# Altium project KNX-RELAY-8CH_V2.PrjPcb
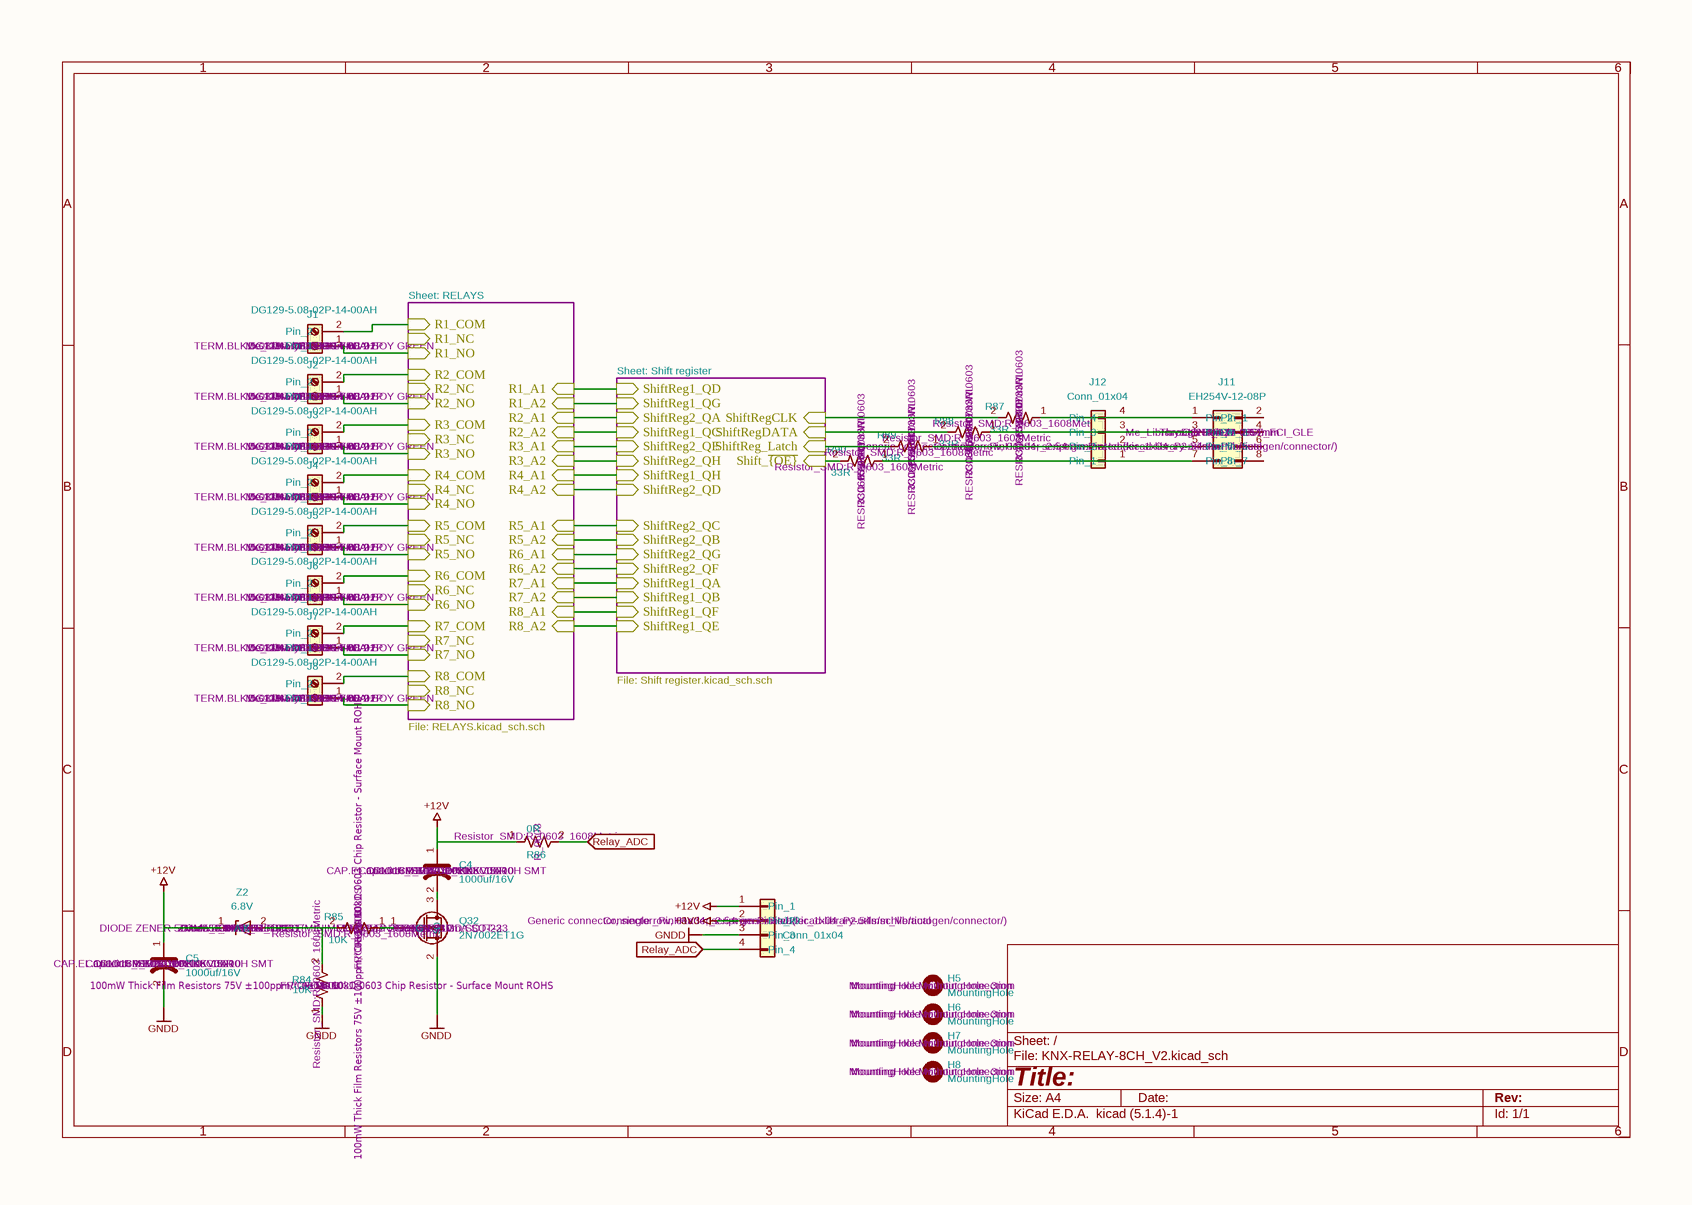
[diagram p0: KNX-RELAY-8CH_V2.SchDoc]
3 sheets, 102 parts. Net scope: hierarchical (ports join the sheet entries above them; power ports are global).
Board file: KNX-RELAY-8CH_V2.PcbDoc
Sheets:
  KNX-RELAY-8CH_V2.SchDoc
    RELAYS = RELAYS.SchDoc
    Shift register = Shift register.SchDoc

## Sheet KNX-RELAY-8CH_V2.SchDoc
size 297 x 209 mm

### Parts
C4  Description: CAP.EL.1000uF 16V 10x10 105C 5000H SMT  MP: CDL016M102G10PKKKV00R  MF: SUSCON  Footprint: Capacitor_SMD:CP_Elec_10x10  [CP_Elec_10x10]  (hidden comment: 1000uf/16V)
C5  Description: CAP.EL.1000uF 16V 10x10 105C 5000H SMT  MP: CDL016M102G10PKKKV00R  MF: SUSCON  Footprint: Capacitor_SMD:CP_Elec_10x10  [CP_Elec_10x10]  (hidden comment: 1000uf/16V)
H5  Description: Mounting Hole without connection  Footprint: MountingHole:MountingHole_3mm  [MountingHole_3mm]  (hidden comment: MountingHole)
H6  Description: Mounting Hole without connection  Footprint: MountingHole:MountingHole_3mm  [MountingHole_3mm]  (hidden comment: MountingHole)
H7  Description: Mounting Hole without connection  Footprint: MountingHole:MountingHole_3mm  [MountingHole_3mm]  (hidden comment: MountingHole)
H8  Description: Mounting Hole without connection  Footprint: MountingHole:MountingHole_3mm  [MountingHole_3mm]  (hidden comment: MountingHole)
J1  Description: TERM.BLK.5.08MM 2P PCB TYPE 2 BOY GREEN  MF: DEGSON  Package: THT V/T  5.08mm  Footprint: Me_Library:DG129-5.08-02P  [DG129-5.08-02P]  (hidden comment: DG129-5.08-02P-14-00AH)
J2  Description: TERM.BLK.5.08MM 2P PCB TYPE 2 BOY GREEN  MF: DEGSON  Package: THT V/T  5.08mm  Footprint: Me_Library:DG129-5.08-02P  [DG129-5.08-02P]  (hidden comment: DG129-5.08-02P-14-00AH)
J3  Description: TERM.BLK.5.08MM 2P PCB TYPE 2 BOY GREEN  MF: DEGSON  Package: THT V/T  5.08mm  Footprint: Me_Library:DG129-5.08-02P  [DG129-5.08-02P]  (hidden comment: DG129-5.08-02P-14-00AH)
J4  Description: TERM.BLK.5.08MM 2P PCB TYPE 2 BOY GREEN  MF: DEGSON  Package: THT V/T  5.08mm  Footprint: Me_Library:DG129-5.08-02P  [DG129-5.08-02P]  (hidden comment: DG129-5.08-02P-14-00AH)
J5  Description: TERM.BLK.5.08MM 2P PCB TYPE 2 BOY GREEN  MF: DEGSON  Package: THT V/T  5.08mm  Footprint: Me_Library:DG129-5.08-02P  [DG129-5.08-02P]  (hidden comment: DG129-5.08-02P-14-00AH)
J6  Description: TERM.BLK.5.08MM 2P PCB TYPE 2 BOY GREEN  MF: DEGSON  Package: THT V/T  5.08mm  Footprint: Me_Library:DG129-5.08-02P  [DG129-5.08-02P]  (hidden comment: DG129-5.08-02P-14-00AH)
J7  Description: TERM.BLK.5.08MM 2P PCB TYPE 2 BOY GREEN  MF: DEGSON  Package: THT V/T  5.08mm  Footprint: Me_Library:DG129-5.08-02P  [DG129-5.08-02P]  (hidden comment: DG129-5.08-02P-14-00AH)
J8  Description: TERM.BLK.5.08MM 2P PCB TYPE 2 BOY GREEN  MF: DEGSON  Package: THT V/T  5.08mm  Footprint: Me_Library:DG129-5.08-02P  [DG129-5.08-02P]  (hidden comment: DG129-5.08-02P-14-00AH)
J10  Description: Generic connector, single row, 01x04, script generated (kicad-library-utils/schlib/autogen/connector/)  Footprint: Connector_PinHeader_2.54mm:PinHeader_1x04_P2.54mm_Vertical  [PinHeader_1x04_P2.54mm_Vertical]  (hidden comment: Conn_01x04)
J11  Description: Through Hole,P=2.54mm  MF: XFCN  Footprint: Me_Library:CON8_2X4_USZ_FCI_GLE  [CON8_2X4_USZ_FCI_GLE]  (hidden comment: EH254V-12-08P)
J12  Description: Generic connector, single row, 01x04, script generated (kicad-library-utils/schlib/autogen/connector/)  Footprint: Connector_PinHeader_2.54mm:PinHeader_1x04_P2.54mm_Vertical  [PinHeader_1x04_P2.54mm_Vertical]  (hidden comment: Conn_01x04)
Q32  Description: MOSFET N-CH 60V 310mA SOT-23  MF: onsemi  Footprint: Package_TO_SOT_SMD:SOT-23  [SOT-23]  (hidden comment: 2N7002ET1G)
R84  Description: 100mW Thick Film Resistors 75V ±100ppm/℃ ±5% 10kΩ 0603 Chip Resistor - Surface Mount ROHS  MP: FRC0603J103TS  MF: FOJAN  Package: R_0603  Footprint: Resistor_SMD:R_0603_1608Metric  [R_0603_1608Metric]  (hidden comment: 10K)
R85  Description: 100mW Thick Film Resistors 75V ±100ppm/℃ ±5% 10kΩ 0603 Chip Resistor - Surface Mount ROHS  MP: FRC0603J103TS  MF: FOJAN  Package: R_0603  Footprint: Resistor_SMD:R_0603_1608Metric  [R_0603_1608Metric]  (hidden comment: 10K)
R86  Package: R_0603  Footprint: Resistor_SMD:R_0603_1608Metric  [R_0603_1608Metric]  (hidden comment: 0R)
R87  Description: RES 33Ω ±5% 100mW 0603  MP: RC0603JR-0733RL  MF: YAGEO  Package: R_0603  Footprint: Resistor_SMD:R_0603_1608Metric  [R_0603_1608Metric]  (hidden comment: 33R)
R88  Description: RES 33Ω ±5% 100mW 0603  MP: RC0603JR-0733RL  MF: YAGEO  Package: R_0603  Footprint: Resistor_SMD:R_0603_1608Metric  [R_0603_1608Metric]  (hidden comment: 33R)
R89  Description: RES 33Ω ±5% 100mW 0603  MP: RC0603JR-0733RL  MF: YAGEO  Package: R_0603  Footprint: Resistor_SMD:R_0603_1608Metric  [R_0603_1608Metric]  (hidden comment: 33R)
R90  Description: RES 33Ω ±5% 100mW 0603  MP: RC0603JR-0733RL  MF: YAGEO  Package: R_0603  Footprint: Resistor_SMD:R_0603_1608Metric  [R_0603_1608Metric]  (hidden comment: 33R)
Z2  Description: DIODE ZENER 500mW 6.8V ±5% SOD80 (MINIMELF) SMT  MP: ZMM55-C6V8_R1_10001  MF: PANJIT  Footprint: Diode_SMD:D_MiniMELF  [D_MiniMELF]  (hidden comment: 6.8V)

### Sub-sheets
RELAYS = RELAYS.SchDoc: R1_A1 (in), R1_A2 (in), R1_COM (in), R1_NC (in), R1_NO (in), R2_A1 (in), R2_A2 (in), R2_COM (in), R2_NC (in), R2_NO (in), R3_A1 (in), R3_A2 (in), R3_COM (in), R3_NC (in), R3_NO (in), R4_A1 (in), R4_A2 (in), R4_COM (in), R4_NC (in), R4_NO (in), R5_A1 (in), R5_A2 (in), R5_COM (in), R5_NC (in), R5_NO (in), R6_A1 (in), R6_A2 (in), R6_COM (in), R6_NC (in), R6_NO (in), R7_A1 (in), R7_A2 (in), R7_COM (in), R7_NC (in), R7_NO (in), R8_A1 (in), R8_A2 (in), R8_COM (in), R8_NC (in), R8_NO (in)
Shift register = Shift register.SchDoc: ShiftReg1_QA (in), ShiftReg1_QB (in), ShiftReg1_QC (in), ShiftReg1_QD (in), ShiftReg1_QE (in), ShiftReg1_QF (in), ShiftReg1_QG (in), ShiftReg1_QH (in), ShiftReg2_QA (in), ShiftReg2_QB (in), ShiftReg2_QC (in), ShiftReg2_QD (in), ShiftReg2_QE (in), ShiftReg2_QF (in), ShiftReg2_QG (in), ShiftReg2_QH (in), ShiftRegCLK (in), ShiftRegDATA (in), ShiftReg_Latch (in), Shift_~{{OE}} (in)

### Ports
Relay_ADC (in)

### Nets
+3V3: J10.2(Pin_2)
+12V: C4.1 C5.1 J10.1(Pin_1) R86.1 Z2.1(K)
GNDD: C5.2 J10.3(Pin_3) Q32.2(S) R84.1
R1_A1: sheet RELAYS/R1_A1, sheet Shift register/ShiftReg1_QD
R1_A2: sheet RELAYS/R1_A2, sheet Shift register/ShiftReg1_QG
R1_COM: J1.2(Pin_2) ; sheet RELAYS/R1_COM
R1_NO: J1.1(Pin_1) ; sheet RELAYS/R1_NO
R2_A1: sheet RELAYS/R2_A1, sheet Shift register/ShiftReg2_QA
R2_A2: sheet RELAYS/R2_A2, sheet Shift register/ShiftReg1_QC
R2_COM: J2.2(Pin_2) ; sheet RELAYS/R2_COM
R2_NO: J2.1(Pin_1) ; sheet RELAYS/R2_NO
R3_A1: sheet RELAYS/R3_A1, sheet Shift register/ShiftReg2_QE
R3_A2: sheet RELAYS/R3_A2, sheet Shift register/ShiftReg2_QH
R3_COM: J3.2(Pin_2) ; sheet RELAYS/R3_COM
R3_NO: J3.1(Pin_1) ; sheet RELAYS/R3_NO
R4_A1: sheet RELAYS/R4_A1, sheet Shift register/ShiftReg1_QH
R4_A2: sheet RELAYS/R4_A2, sheet Shift register/ShiftReg2_QD
R4_COM: J4.2(Pin_2) ; sheet RELAYS/R4_COM
R4_NO: J4.1(Pin_1) ; sheet RELAYS/R4_NO
R5_A1: sheet RELAYS/R5_A1, sheet Shift register/ShiftReg2_QC
R5_A2: sheet RELAYS/R5_A2, sheet Shift register/ShiftReg2_QB
R5_COM: J5.2(Pin_2) ; sheet RELAYS/R5_COM
R5_NO: J5.1(Pin_1) ; sheet RELAYS/R5_NO
R6_A1: sheet RELAYS/R6_A1, sheet Shift register/ShiftReg2_QG
R6_A2: sheet RELAYS/R6_A2, sheet Shift register/ShiftReg2_QF
R6_COM: J6.2(Pin_2) ; sheet RELAYS/R6_COM
R6_NO: J6.1(Pin_1) ; sheet RELAYS/R6_NO
R7_A1: sheet RELAYS/R7_A1, sheet Shift register/ShiftReg1_QA
R7_A2: sheet RELAYS/R7_A2, sheet Shift register/ShiftReg1_QB
R7_COM: J7.2(Pin_2) ; sheet RELAYS/R7_COM
R7_NO: J7.1(Pin_1) ; sheet RELAYS/R7_NO
R8_A1: sheet RELAYS/R8_A1, sheet Shift register/ShiftReg1_QF
R8_A2: sheet RELAYS/R8_A2, sheet Shift register/ShiftReg1_QE
R8_COM: J8.2(Pin_2) ; sheet RELAYS/R8_COM
R8_NO: J8.1(Pin_1) ; sheet RELAYS/R8_NO
Relay_ADC: J10.4(Pin_4) R86.2 ; port Relay_ADC
Shift_~{{OE}}: R90.2 ; sheet Shift register/Shift_~{{OE}}
ShiftReg_Latch: R89.2 ; sheet Shift register/ShiftReg_Latch
ShiftRegCLK: R87.2 ; sheet Shift register/ShiftRegCLK
ShiftRegDATA: R88.2 ; sheet Shift register/ShiftRegDATA
NetC4_2: C4.2 Q32.3(D)
NetJ11_1: J11.1(Pin_1) J12.4(Pin_4) R87.1
NetJ11_3: J11.3(Pin_3) J12.3(Pin_3) R88.1
NetJ11_5: J11.5(Pin_5) J12.2(Pin_2) R89.1
NetJ11_7: J11.7(Pin_7) J12.1(Pin_1) R90.1
NetQ32_1: Q32.1(G) R85.1
NetR84_2: R84.2 R85.2 Z2.2(A)

Not connected (* = marked no-connect by the designer): J11 2(Pin_2) 4(Pin_4) 6(Pin_6) 8(Pin_8)

### Notes on the sheet
- Sheet: RELAYS
- Sheet: Shift register
- File: RELAYS.kicad_sch.sch
- File: Shift register.kicad_sch.sch
- 1
- 2
- 3
- 4
- 5
- 6
- A
- B
- C
- D
- Title:
- File: KNX-RELAY-8CH_V2.kicad_sch
- Sheet: /
- KiCad E.D.A.  kicad (5.1.4)-1
- Size: A4
- Date:
- Rev:
- Id: 1/1

### Library data of the parts
C4 C5 = C_US: Package: CP_Elec_10x10; OZD: CDL016M102G10PKKKV00R; Value: 1000uf/16V
J1-J8 = Screw_Terminal_01x02: MP: DG129-5.08-02P-14-00AH; OZD: DG129-5.08-02P-14-00AH; Value: DG129-5.08-02P-14-00AH
J11 = Conn_02x04_Odd_Even: MP: EH254V-12-08P; Package: Through Hole,P=2.54mm; Value: EH254V-12-08P
Q32 = Q_NMOS_Depletion_GSD: MP: 2N7002ET1G; Package: SOT-23; OZD: 2N7002ET1G; Value: 2N7002ET1G
R84-R90 = R_US
  R84 R85: Value: 10K
  R86: Value: 0R
  R87-R90: OZD: RC0603JR-0733RL; Value: 33R
Z2 = D_Zener: Package: D_MiniMELF; OZD: ZMM55-C6V8_R1_10001; Value: 6.8V
H5-H8 = MountingHole: Value: MountingHole
J10 J12 = Conn_01x04: Value: Conn_01x04

## Sheet RELAYS.SchDoc
size 420 x 297 mm
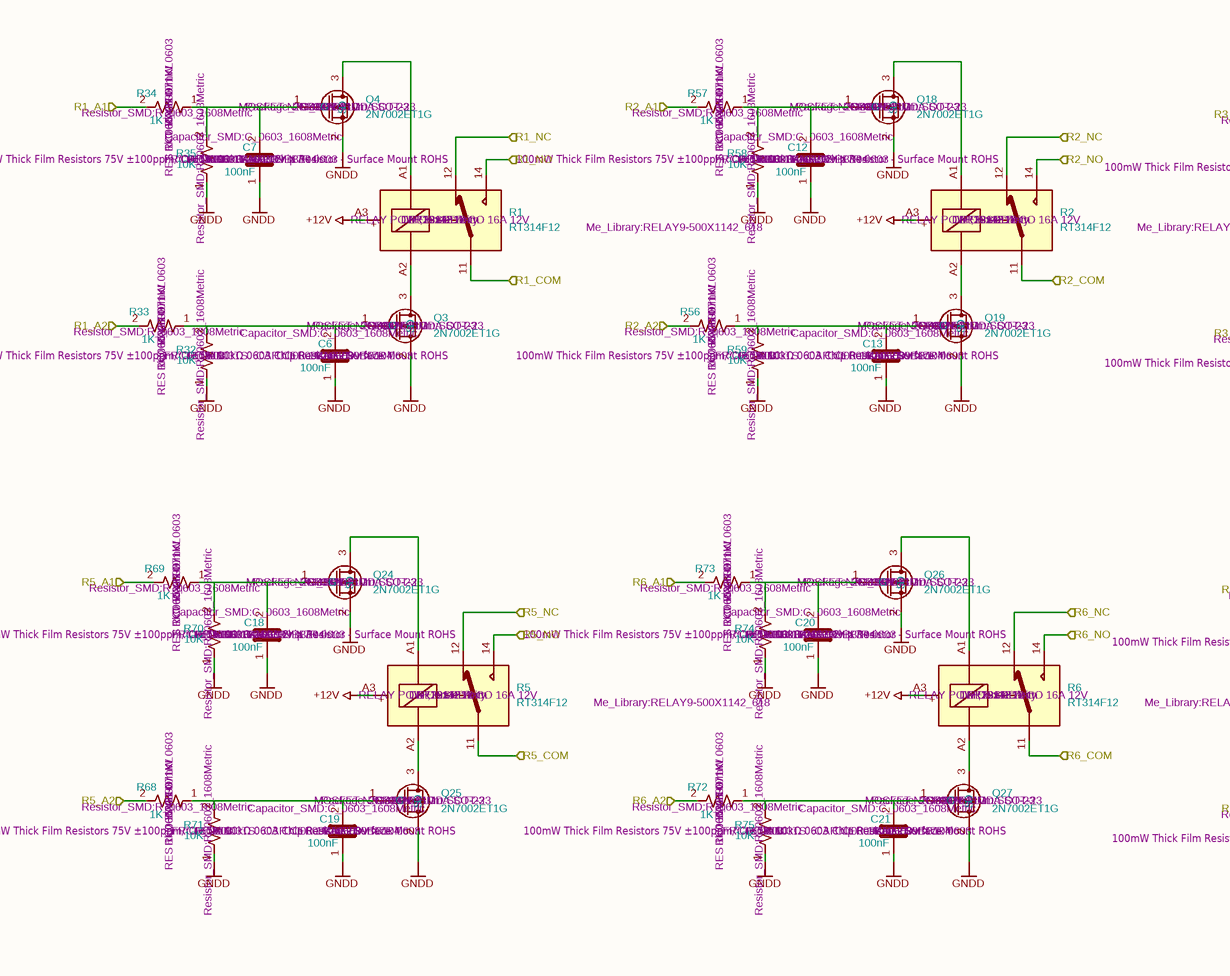
[diagram p1: RELAYS.SchDoc, left]
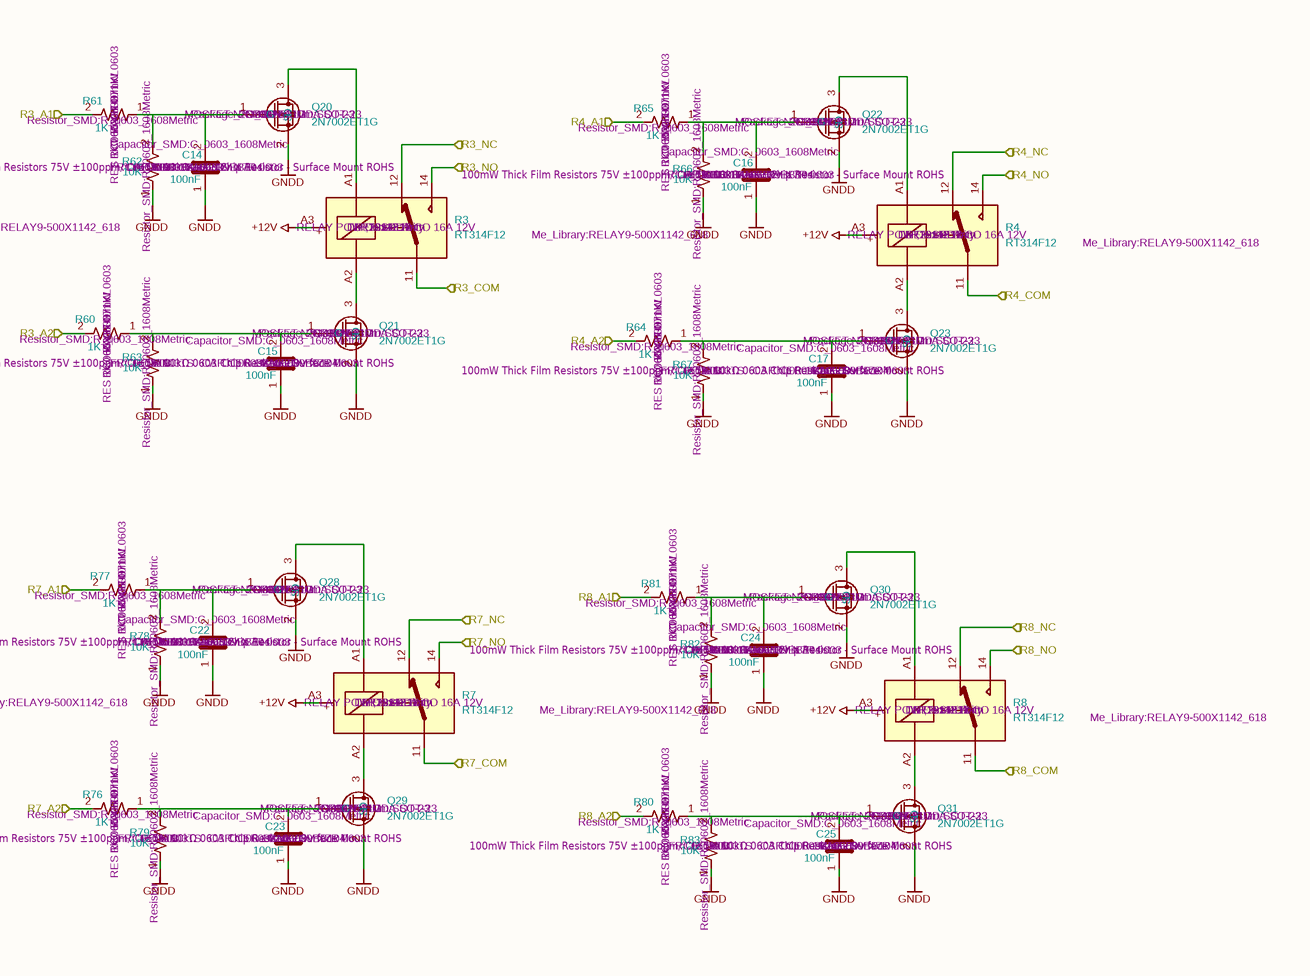
[diagram p2: RELAYS.SchDoc, right]

### Parts
C6  Description: CAP CER 100nF 50V X7R 0603  MP: CC0603KRX7R9BB104  MF: YAGEO  Package: C_0603  Footprint: Capacitor_SMD:C_0603_1608Metric  [C_0603_1608Metric]  (hidden comment: 100nF)
C7  Description: CAP CER 100nF 50V X7R 0603  MP: CC0603KRX7R9BB104  MF: YAGEO  Package: C_0603  Footprint: Capacitor_SMD:C_0603_1608Metric  [C_0603_1608Metric]  (hidden comment: 100nF)
C12  Description: CAP CER 100nF 50V X7R 0603  MP: CC0603KRX7R9BB104  MF: YAGEO  Package: C_0603  Footprint: Capacitor_SMD:C_0603_1608Metric  [C_0603_1608Metric]  (hidden comment: 100nF)
C13  Description: CAP CER 100nF 50V X7R 0603  MP: CC0603KRX7R9BB104  MF: YAGEO  Package: C_0603  Footprint: Capacitor_SMD:C_0603_1608Metric  [C_0603_1608Metric]  (hidden comment: 100nF)
C14  Description: CAP CER 100nF 50V X7R 0603  MP: CC0603KRX7R9BB104  MF: YAGEO  Package: C_0603  Footprint: Capacitor_SMD:C_0603_1608Metric  [C_0603_1608Metric]  (hidden comment: 100nF)
C15  Description: CAP CER 100nF 50V X7R 0603  MP: CC0603KRX7R9BB104  MF: YAGEO  Package: C_0603  Footprint: Capacitor_SMD:C_0603_1608Metric  [C_0603_1608Metric]  (hidden comment: 100nF)
C16  Description: CAP CER 100nF 50V X7R 0603  MP: CC0603KRX7R9BB104  MF: YAGEO  Package: C_0603  Footprint: Capacitor_SMD:C_0603_1608Metric  [C_0603_1608Metric]  (hidden comment: 100nF)
C17  Description: CAP CER 100nF 50V X7R 0603  MP: CC0603KRX7R9BB104  MF: YAGEO  Package: C_0603  Footprint: Capacitor_SMD:C_0603_1608Metric  [C_0603_1608Metric]  (hidden comment: 100nF)
C18  Description: CAP CER 100nF 50V X7R 0603  MP: CC0603KRX7R9BB104  MF: YAGEO  Package: C_0603  Footprint: Capacitor_SMD:C_0603_1608Metric  [C_0603_1608Metric]  (hidden comment: 100nF)
C19  Description: CAP CER 100nF 50V X7R 0603  MP: CC0603KRX7R9BB104  MF: YAGEO  Package: C_0603  Footprint: Capacitor_SMD:C_0603_1608Metric  [C_0603_1608Metric]  (hidden comment: 100nF)
C20  Description: CAP CER 100nF 50V X7R 0603  MP: CC0603KRX7R9BB104  MF: YAGEO  Package: C_0603  Footprint: Capacitor_SMD:C_0603_1608Metric  [C_0603_1608Metric]  (hidden comment: 100nF)
C21  Description: CAP CER 100nF 50V X7R 0603  MP: CC0603KRX7R9BB104  MF: YAGEO  Package: C_0603  Footprint: Capacitor_SMD:C_0603_1608Metric  [C_0603_1608Metric]  (hidden comment: 100nF)
C22  Description: CAP CER 100nF 50V X7R 0603  MP: CC0603KRX7R9BB104  MF: YAGEO  Package: C_0603  Footprint: Capacitor_SMD:C_0603_1608Metric  [C_0603_1608Metric]  (hidden comment: 100nF)
C23  Description: CAP CER 100nF 50V X7R 0603  MP: CC0603KRX7R9BB104  MF: YAGEO  Package: C_0603  Footprint: Capacitor_SMD:C_0603_1608Metric  [C_0603_1608Metric]  (hidden comment: 100nF)
C24  Description: CAP CER 100nF 50V X7R 0603  MP: CC0603KRX7R9BB104  MF: YAGEO  Package: C_0603  Footprint: Capacitor_SMD:C_0603_1608Metric  [C_0603_1608Metric]  (hidden comment: 100nF)
C25  Description: CAP CER 100nF 50V X7R 0603  MP: CC0603KRX7R9BB104  MF: YAGEO  Package: C_0603  Footprint: Capacitor_SMD:C_0603_1608Metric  [C_0603_1608Metric]  (hidden comment: 100nF)
Q3  Description: MOSFET N-CH 60V 310mA SOT-23  MF: onsemi  Footprint: Package_TO_SOT_SMD:SOT-23  [SOT-23]  (hidden comment: 2N7002ET1G)
Q4  Description: MOSFET N-CH 60V 310mA SOT-23  MF: onsemi  Footprint: Package_TO_SOT_SMD:SOT-23  [SOT-23]  (hidden comment: 2N7002ET1G)
Q18  Description: MOSFET N-CH 60V 310mA SOT-23  MF: onsemi  Footprint: Package_TO_SOT_SMD:SOT-23  [SOT-23]  (hidden comment: 2N7002ET1G)
Q19  Description: MOSFET N-CH 60V 310mA SOT-23  MF: onsemi  Footprint: Package_TO_SOT_SMD:SOT-23  [SOT-23]  (hidden comment: 2N7002ET1G)
Q20  Description: MOSFET N-CH 60V 310mA SOT-23  MF: onsemi  Footprint: Package_TO_SOT_SMD:SOT-23  [SOT-23]  (hidden comment: 2N7002ET1G)
Q21  Description: MOSFET N-CH 60V 310mA SOT-23  MF: onsemi  Footprint: Package_TO_SOT_SMD:SOT-23  [SOT-23]  (hidden comment: 2N7002ET1G)
Q22  Description: MOSFET N-CH 60V 310mA SOT-23  MF: onsemi  Footprint: Package_TO_SOT_SMD:SOT-23  [SOT-23]  (hidden comment: 2N7002ET1G)
Q23  Description: MOSFET N-CH 60V 310mA SOT-23  MF: onsemi  Footprint: Package_TO_SOT_SMD:SOT-23  [SOT-23]  (hidden comment: 2N7002ET1G)
Q24  Description: MOSFET N-CH 60V 310mA SOT-23  MF: onsemi  Footprint: Package_TO_SOT_SMD:SOT-23  [SOT-23]  (hidden comment: 2N7002ET1G)
Q25  Description: MOSFET N-CH 60V 310mA SOT-23  MF: onsemi  Footprint: Package_TO_SOT_SMD:SOT-23  [SOT-23]  (hidden comment: 2N7002ET1G)
Q26  Description: MOSFET N-CH 60V 310mA SOT-23  MF: onsemi  Footprint: Package_TO_SOT_SMD:SOT-23  [SOT-23]  (hidden comment: 2N7002ET1G)
Q27  Description: MOSFET N-CH 60V 310mA SOT-23  MF: onsemi  Footprint: Package_TO_SOT_SMD:SOT-23  [SOT-23]  (hidden comment: 2N7002ET1G)
Q28  Description: MOSFET N-CH 60V 310mA SOT-23  MF: onsemi  Footprint: Package_TO_SOT_SMD:SOT-23  [SOT-23]  (hidden comment: 2N7002ET1G)
Q29  Description: MOSFET N-CH 60V 310mA SOT-23  MF: onsemi  Footprint: Package_TO_SOT_SMD:SOT-23  [SOT-23]  (hidden comment: 2N7002ET1G)
Q30  Description: MOSFET N-CH 60V 310mA SOT-23  MF: onsemi  Footprint: Package_TO_SOT_SMD:SOT-23  [SOT-23]  (hidden comment: 2N7002ET1G)
Q31  Description: MOSFET N-CH 60V 310mA SOT-23  MF: onsemi  Footprint: Package_TO_SOT_SMD:SOT-23  [SOT-23]  (hidden comment: 2N7002ET1G)
R1  Description: RELAY POWER SPDT-CO 16A 12V  MF: TE Connectivity  Package: DIP,29x12.7mm  Footprint: Me_Library:RELAY9-500X1142_618  [RELAY9-500X1142_618]  (hidden comment: RT314F12)
R2  Description: RELAY POWER SPDT-CO 16A 12V  MF: TE Connectivity  Package: DIP,29x12.7mm  Footprint: Me_Library:RELAY9-500X1142_618  [RELAY9-500X1142_618]  (hidden comment: RT314F12)
R3  Description: RELAY POWER SPDT-CO 16A 12V  MF: TE Connectivity  Package: DIP,29x12.7mm  Footprint: Me_Library:RELAY9-500X1142_618  [RELAY9-500X1142_618]  (hidden comment: RT314F12)
R4  Description: RELAY POWER SPDT-CO 16A 12V  MF: TE Connectivity  Package: DIP,29x12.7mm  Footprint: Me_Library:RELAY9-500X1142_618  [RELAY9-500X1142_618]  (hidden comment: RT314F12)
R5  Description: RELAY POWER SPDT-CO 16A 12V  MF: TE Connectivity  Package: DIP,29x12.7mm  Footprint: Me_Library:RELAY9-500X1142_618  [RELAY9-500X1142_618]  (hidden comment: RT314F12)
R6  Description: RELAY POWER SPDT-CO 16A 12V  MF: TE Connectivity  Package: DIP,29x12.7mm  Footprint: Me_Library:RELAY9-500X1142_618  [RELAY9-500X1142_618]  (hidden comment: RT314F12)
R7  Description: RELAY POWER SPDT-CO 16A 12V  MF: TE Connectivity  Package: DIP,29x12.7mm  Footprint: Me_Library:RELAY9-500X1142_618  [RELAY9-500X1142_618]  (hidden comment: RT314F12)
R8  Description: RELAY POWER SPDT-CO 16A 12V  MF: TE Connectivity  Package: DIP,29x12.7mm  Footprint: Me_Library:RELAY9-500X1142_618  [RELAY9-500X1142_618]  (hidden comment: RT314F12)
R32  Description: 100mW Thick Film Resistors 75V ±100ppm/℃ ±5% 10kΩ 0603 Chip Resistor - Surface Mount ROHS  MP: FRC0603J103TS  MF: FOJAN  Package: R_0603  Footprint: Resistor_SMD:R_0603_1608Metric  [R_0603_1608Metric]  (hidden comment: 10K)
R33  Description: RES 1kΩ ±5% 100mW 0603  MP: RC0603JR-071KL  MF: YAGEO  Package: R_0603  Footprint: Resistor_SMD:R_0603_1608Metric  [R_0603_1608Metric]  (hidden comment: 1K)
R34  Description: RES 1kΩ ±5% 100mW 0603  MP: RC0603JR-071KL  MF: YAGEO  Package: R_0603  Footprint: Resistor_SMD:R_0603_1608Metric  [R_0603_1608Metric]  (hidden comment: 1K)
R35  Description: 100mW Thick Film Resistors 75V ±100ppm/℃ ±5% 10kΩ 0603 Chip Resistor - Surface Mount ROHS  MP: FRC0603J103TS  MF: FOJAN  Package: R_0603  Footprint: Resistor_SMD:R_0603_1608Metric  [R_0603_1608Metric]  (hidden comment: 10K)
R56  Description: RES 1kΩ ±5% 100mW 0603  MP: RC0603JR-071KL  MF: YAGEO  Package: R_0603  Footprint: Resistor_SMD:R_0603_1608Metric  [R_0603_1608Metric]  (hidden comment: 1K)
R57  Description: RES 1kΩ ±5% 100mW 0603  MP: RC0603JR-071KL  MF: YAGEO  Package: R_0603  Footprint: Resistor_SMD:R_0603_1608Metric  [R_0603_1608Metric]  (hidden comment: 1K)
R58  Description: 100mW Thick Film Resistors 75V ±100ppm/℃ ±5% 10kΩ 0603 Chip Resistor - Surface Mount ROHS  MP: FRC0603J103TS  MF: FOJAN  Package: R_0603  Footprint: Resistor_SMD:R_0603_1608Metric  [R_0603_1608Metric]  (hidden comment: 10K)
R59  Description: 100mW Thick Film Resistors 75V ±100ppm/℃ ±5% 10kΩ 0603 Chip Resistor - Surface Mount ROHS  MP: FRC0603J103TS  MF: FOJAN  Package: R_0603  Footprint: Resistor_SMD:R_0603_1608Metric  [R_0603_1608Metric]  (hidden comment: 10K)
R60  Description: RES 1kΩ ±5% 100mW 0603  MP: RC0603JR-071KL  MF: YAGEO  Package: R_0603  Footprint: Resistor_SMD:R_0603_1608Metric  [R_0603_1608Metric]  (hidden comment: 1K)
R61  Description: RES 1kΩ ±5% 100mW 0603  MP: RC0603JR-071KL  MF: YAGEO  Package: R_0603  Footprint: Resistor_SMD:R_0603_1608Metric  [R_0603_1608Metric]  (hidden comment: 1K)
R62  Description: 100mW Thick Film Resistors 75V ±100ppm/℃ ±5% 10kΩ 0603 Chip Resistor - Surface Mount ROHS  MP: FRC0603J103TS  MF: FOJAN  Package: R_0603  Footprint: Resistor_SMD:R_0603_1608Metric  [R_0603_1608Metric]  (hidden comment: 10K)
R63  Description: 100mW Thick Film Resistors 75V ±100ppm/℃ ±5% 10kΩ 0603 Chip Resistor - Surface Mount ROHS  MP: FRC0603J103TS  MF: FOJAN  Package: R_0603  Footprint: Resistor_SMD:R_0603_1608Metric  [R_0603_1608Metric]  (hidden comment: 10K)
R64  Description: RES 1kΩ ±5% 100mW 0603  MP: RC0603JR-071KL  MF: YAGEO  Package: R_0603  Footprint: Resistor_SMD:R_0603_1608Metric  [R_0603_1608Metric]  (hidden comment: 1K)
R65  Description: RES 1kΩ ±5% 100mW 0603  MP: RC0603JR-071KL  MF: YAGEO  Package: R_0603  Footprint: Resistor_SMD:R_0603_1608Metric  [R_0603_1608Metric]  (hidden comment: 1K)
R66  Description: 100mW Thick Film Resistors 75V ±100ppm/℃ ±5% 10kΩ 0603 Chip Resistor - Surface Mount ROHS  MP: FRC0603J103TS  MF: FOJAN  Package: R_0603  Footprint: Resistor_SMD:R_0603_1608Metric  [R_0603_1608Metric]  (hidden comment: 10K)
R67  Description: 100mW Thick Film Resistors 75V ±100ppm/℃ ±5% 10kΩ 0603 Chip Resistor - Surface Mount ROHS  MP: FRC0603J103TS  MF: FOJAN  Package: R_0603  Footprint: Resistor_SMD:R_0603_1608Metric  [R_0603_1608Metric]  (hidden comment: 10K)
R68  Description: RES 1kΩ ±5% 100mW 0603  MP: RC0603JR-071KL  MF: YAGEO  Package: R_0603  Footprint: Resistor_SMD:R_0603_1608Metric  [R_0603_1608Metric]  (hidden comment: 1K)
R69  Description: RES 1kΩ ±5% 100mW 0603  MP: RC0603JR-071KL  MF: YAGEO  Package: R_0603  Footprint: Resistor_SMD:R_0603_1608Metric  [R_0603_1608Metric]  (hidden comment: 1K)
R70  Description: 100mW Thick Film Resistors 75V ±100ppm/℃ ±5% 10kΩ 0603 Chip Resistor - Surface Mount ROHS  MP: FRC0603J103TS  MF: FOJAN  Package: R_0603  Footprint: Resistor_SMD:R_0603_1608Metric  [R_0603_1608Metric]  (hidden comment: 10K)
R71  Description: 100mW Thick Film Resistors 75V ±100ppm/℃ ±5% 10kΩ 0603 Chip Resistor - Surface Mount ROHS  MP: FRC0603J103TS  MF: FOJAN  Package: R_0603  Footprint: Resistor_SMD:R_0603_1608Metric  [R_0603_1608Metric]  (hidden comment: 10K)
R72  Description: RES 1kΩ ±5% 100mW 0603  MP: RC0603JR-071KL  MF: YAGEO  Package: R_0603  Footprint: Resistor_SMD:R_0603_1608Metric  [R_0603_1608Metric]  (hidden comment: 1K)
R73  Description: RES 1kΩ ±5% 100mW 0603  MP: RC0603JR-071KL  MF: YAGEO  Package: R_0603  Footprint: Resistor_SMD:R_0603_1608Metric  [R_0603_1608Metric]  (hidden comment: 1K)
R74  Description: 100mW Thick Film Resistors 75V ±100ppm/℃ ±5% 10kΩ 0603 Chip Resistor - Surface Mount ROHS  MP: FRC0603J103TS  MF: FOJAN  Package: R_0603  Footprint: Resistor_SMD:R_0603_1608Metric  [R_0603_1608Metric]  (hidden comment: 10K)
R75  Description: 100mW Thick Film Resistors 75V ±100ppm/℃ ±5% 10kΩ 0603 Chip Resistor - Surface Mount ROHS  MP: FRC0603J103TS  MF: FOJAN  Package: R_0603  Footprint: Resistor_SMD:R_0603_1608Metric  [R_0603_1608Metric]  (hidden comment: 10K)
R76  Description: RES 1kΩ ±5% 100mW 0603  MP: RC0603JR-071KL  MF: YAGEO  Package: R_0603  Footprint: Resistor_SMD:R_0603_1608Metric  [R_0603_1608Metric]  (hidden comment: 1K)
R77  Description: RES 1kΩ ±5% 100mW 0603  MP: RC0603JR-071KL  MF: YAGEO  Package: R_0603  Footprint: Resistor_SMD:R_0603_1608Metric  [R_0603_1608Metric]  (hidden comment: 1K)
R78  Description: 100mW Thick Film Resistors 75V ±100ppm/℃ ±5% 10kΩ 0603 Chip Resistor - Surface Mount ROHS  MP: FRC0603J103TS  MF: FOJAN  Package: R_0603  Footprint: Resistor_SMD:R_0603_1608Metric  [R_0603_1608Metric]  (hidden comment: 10K)
R79  Description: 100mW Thick Film Resistors 75V ±100ppm/℃ ±5% 10kΩ 0603 Chip Resistor - Surface Mount ROHS  MP: FRC0603J103TS  MF: FOJAN  Package: R_0603  Footprint: Resistor_SMD:R_0603_1608Metric  [R_0603_1608Metric]  (hidden comment: 10K)
R80  Description: RES 1kΩ ±5% 100mW 0603  MP: RC0603JR-071KL  MF: YAGEO  Package: R_0603  Footprint: Resistor_SMD:R_0603_1608Metric  [R_0603_1608Metric]  (hidden comment: 1K)
R81  Description: RES 1kΩ ±5% 100mW 0603  MP: RC0603JR-071KL  MF: YAGEO  Package: R_0603  Footprint: Resistor_SMD:R_0603_1608Metric  [R_0603_1608Metric]  (hidden comment: 1K)
R82  Description: 100mW Thick Film Resistors 75V ±100ppm/℃ ±5% 10kΩ 0603 Chip Resistor - Surface Mount ROHS  MP: FRC0603J103TS  MF: FOJAN  Package: R_0603  Footprint: Resistor_SMD:R_0603_1608Metric  [R_0603_1608Metric]  (hidden comment: 10K)
R83  Description: 100mW Thick Film Resistors 75V ±100ppm/℃ ±5% 10kΩ 0603 Chip Resistor - Surface Mount ROHS  MP: FRC0603J103TS  MF: FOJAN  Package: R_0603  Footprint: Resistor_SMD:R_0603_1608Metric  [R_0603_1608Metric]  (hidden comment: 10K)

### Ports
R1_A1 (in), R1_A2 (in), R1_COM (in), R1_NC (in), R1_NO (in), R2_A1 (in), R2_A2 (in), R2_COM (in), R2_NC (in), R2_NO (in), R3_A1 (in), R3_A2 (in), R3_COM (in), R3_NC (in), R3_NO (in), R4_A1 (in), R4_A2 (in), R4_COM (in), R4_NC (in), R4_NO (in), R5_A1 (in), R5_A2 (in), R5_COM (in), R5_NC (in), R5_NO (in), R6_A1 (in), R6_A2 (in), R6_COM (in), R6_NC (in), R6_NO (in), R7_A1 (in), R7_A2 (in), R7_COM (in), R7_NC (in), R7_NO (in), R8_A1 (in), R8_A2 (in), R8_COM (in), R8_NC (in), R8_NO (in)

### Nets
+12V: R1.A3 R2.A3 R3.A3 R4.A3 R5.A3 R6.A3 R7.A3 R8.A3
GNDD: C6.1 C7.1 C12.1 C13.1 C14.1 C15.1 C16.1 C17.1 C18.1 C19.1 C20.1 C21.1 C22.1 C23.1 C24.1 C25.1 Q3.2(S) Q4.2(S) Q18.2(S) Q19.2(S) Q20.2(S) Q21.2(S) Q22.2(S) Q23.2(S) Q24.2(S) Q25.2(S) Q26.2(S) Q27.2(S) Q28.2(S) Q29.2(S) Q30.2(S) Q31.2(S) R32.1 R35.1 R58.1 R59.1 R62.1 R63.1 R66.1 R67.1 R70.1 R71.1 R74.1 R75.1 R78.1 R79.1 R82.1 R83.1
R1_A1: R34.2 ; port R1_A1
R1_A2: R33.2 ; port R1_A2
R1_COM: R1.11 ; port R1_COM
R1_NC: R1.12 ; port R1_NC
R1_NO: R1.14 ; port R1_NO
R2_A1: R57.2 ; port R2_A1
R2_A2: R56.2 ; port R2_A2
R2_COM: R2.11 ; port R2_COM
R2_NC: R2.12 ; port R2_NC
R2_NO: R2.14 ; port R2_NO
R3_A1: R61.2 ; port R3_A1
R3_A2: R60.2 ; port R3_A2
R3_COM: R3.11 ; port R3_COM
R3_NC: R3.12 ; port R3_NC
R3_NO: R3.14 ; port R3_NO
R4_A1: R65.2 ; port R4_A1
R4_A2: R64.2 ; port R4_A2
R4_COM: R4.11 ; port R4_COM
R4_NC: R4.12 ; port R4_NC
R4_NO: R4.14 ; port R4_NO
R5_A1: R69.2 ; port R5_A1
R5_A2: R68.2 ; port R5_A2
R5_COM: R5.11 ; port R5_COM
R5_NC: R5.12 ; port R5_NC
R5_NO: R5.14 ; port R5_NO
R6_A1: R73.2 ; port R6_A1
R6_A2: R72.2 ; port R6_A2
R6_COM: R6.11 ; port R6_COM
R6_NC: R6.12 ; port R6_NC
R6_NO: R6.14 ; port R6_NO
R7_A1: R77.2 ; port R7_A1
R7_A2: R76.2 ; port R7_A2
R7_COM: R7.11 ; port R7_COM
R7_NC: R7.12 ; port R7_NC
R7_NO: R7.14 ; port R7_NO
R8_A1: R81.2 ; port R8_A1
R8_A2: R80.2 ; port R8_A2
R8_COM: R8.11 ; port R8_COM
R8_NC: R8.12 ; port R8_NC
R8_NO: R8.14 ; port R8_NO
NetC6_2: C6.2 Q3.1(G) R32.2 R33.1
NetC7_2: C7.2 Q4.1(G) R34.1 R35.2
NetC12_2: C12.2 Q18.1(G) R57.1 R58.2
NetC13_2: C13.2 Q19.1(G) R56.1 R59.2
NetC14_2: C14.2 Q20.1(G) R61.1 R62.2
NetC15_2: C15.2 Q21.1(G) R60.1 R63.2
NetC16_2: C16.2 Q22.1(G) R65.1 R66.2
NetC17_2: C17.2 Q23.1(G) R64.1 R67.2
NetC18_2: C18.2 Q24.1(G) R69.1 R70.2
NetC19_2: C19.2 Q25.1(G) R68.1 R71.2
NetC20_2: C20.2 Q26.1(G) R73.1 R74.2
NetC21_2: C21.2 Q27.1(G) R72.1 R75.2
NetC22_2: C22.2 Q28.1(G) R77.1 R78.2
NetC23_2: C23.2 Q29.1(G) R76.1 R79.2
NetC24_2: C24.2 Q30.1(G) R81.1 R82.2
NetC25_2: C25.2 Q31.1(G) R80.1 R83.2
NetQ3_3: Q3.3(D) R1.A2
NetQ4_3: Q4.3(D) R1.A1
NetQ18_3: Q18.3(D) R2.A1
NetQ19_3: Q19.3(D) R2.A2
NetQ20_3: Q20.3(D) R3.A1
NetQ21_3: Q21.3(D) R3.A2
NetQ22_3: Q22.3(D) R4.A1
NetQ23_3: Q23.3(D) R4.A2
NetQ24_3: Q24.3(D) R5.A1
NetQ25_3: Q25.3(D) R5.A2
NetQ26_3: Q26.3(D) R6.A1
NetQ27_3: Q27.3(D) R6.A2
NetQ28_3: Q28.3(D) R7.A1
NetQ29_3: Q29.3(D) R7.A2
NetQ30_3: Q30.3(D) R8.A1
NetQ31_3: Q31.3(D) R8.A2

### Notes on the sheet
- 1
- 2
- 3
- 4
- 5
- 6
- 7
- 8
- A
- B
- C
- D
- E
- Title:
- File: RELAYS.kicad_sch
- Sheet: /
- F
- KiCad E.D.A.  kicad (5.1.4)-1
- Size: A3
- Date:
- Rev:
- Id: 1/1
- (in symbol RT314A03) +

### Library data of the parts
C6 C7 C12-C25 = C_3: Value: 100nF
Q3 Q4 Q18-Q31 = Q_NMOS_Depletion_GSD: MP: 2N7002ET1G; Package: SOT-23; OZD: 2N7002ET1G; Value: 2N7002ET1G
R1-R8 = RT314A03: MP: RT314F12; OZD: RT314F12; Value: RT314F12
R32-R35 R56-R83 = R_US
  R32 R35 R58 R59 R62 R63 R66 R67 R70 R71 R74 R75 R78 R79 R82 R83: Value: 10K
  R33 R34 R56 R57 R60 R61 R64 R65 R68 R69 R72 R73 R76 R77 R80 R81: OZD: RC0603JR-071KL; Value: 1K

## Sheet Shift register.SchDoc
size 297 x 209 mm
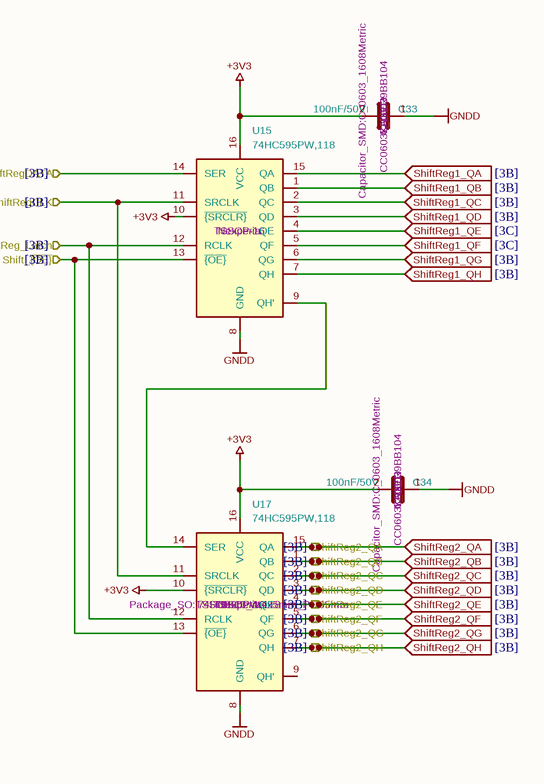
[diagram p3: Shift register.SchDoc]

### Parts
C33  MP: CC0603KRX7R9BB104  MF: YAGEO  Package: C_0603  Footprint: Capacitor_SMD:C_0603_1608Metric  [C_0603_1608Metric]  (hidden comment: 100nF/50V)
C34  MP: CC0603KRX7R9BB104  MF: YAGEO  Package: C_0603  Footprint: Capacitor_SMD:C_0603_1608Metric  [C_0603_1608Metric]  (hidden comment: 100nF/50V)
U15  MF: Nexperia  Package: TSSOP-16  [TSSOP-16_4.4x5mm_P0.65mm]  (hidden comment: 74HC595PW,118)
U17  MF: Nexperia  Package: TSSOP-16  Footprint: Package_SO:TSSOP-16_4.4x5mm_P0.65mm  [TSSOP-16_4.4x5mm_P0.65mm]  (hidden comment: 74HC595PW,118)

### Ports
Shift_~{{OE}} (in, see [3B]), ShiftReg1_QA (in, see [3B]), ShiftReg1_QB (in, see [3B]), ShiftReg1_QC (in, see [3B]), ShiftReg1_QD (in, see [3B]), ShiftReg1_QE (in, see [3C]), ShiftReg1_QF (in, see [3C]), ShiftReg1_QG (in, see [3B]), ShiftReg1_QH (in, see [3B]), ShiftReg2_QA (in, see [3B]), ShiftReg2_QB (in, see [3B]), ShiftReg2_QC (in, see [3B]), ShiftReg2_QD (in, see [3B]), ShiftReg2_QE (in, see [3B]), ShiftReg2_QF (in, see [3B]), ShiftReg2_QG (in, see [3B]), ShiftReg2_QH (in, see [3B]), ShiftReg_Latch (in, see [3B]), ShiftRegCLK (in, see [3B]), ShiftRegDATA (in, see [3B])

### Nets
+3V3: C33.2 C34.2 U15.10(~{{SRCLR}}) U15.16(VCC) U17.10(~{{SRCLR}}) U17.16(VCC)
GNDD: C33.1 C34.1 U15.8(GND) U17.8(GND)
R1_A1: U15.3(QD) ; port ShiftReg1_QD
R1_A2: U15.6(QG) ; port ShiftReg1_QG
R2_A1: U17.15(QA) ; port ShiftReg2_QA
R2_A2: U15.2(QC) ; port ShiftReg1_QC
R3_A1: U17.4(QE) ; port ShiftReg2_QE
R3_A2: U17.7(QH) ; port ShiftReg2_QH
R4_A1: U15.7(QH) ; port ShiftReg1_QH
R4_A2: U17.3(QD) ; port ShiftReg2_QD
R5_A1: U17.2(QC) ; port ShiftReg2_QC
R5_A2: U17.1(QB) ; port ShiftReg2_QB
R6_A1: U17.6(QG) ; port ShiftReg2_QG
R6_A2: U17.5(QF) ; port ShiftReg2_QF
R7_A1: U15.15(QA) ; port ShiftReg1_QA
R7_A2: U15.1(QB) ; port ShiftReg1_QB
R8_A1: U15.5(QF) ; port ShiftReg1_QF
R8_A2: U15.4(QE) ; port ShiftReg1_QE
Shift_~{{OE}}: U15.13(~{{OE}}) U17.13(~{{OE}}) ; port Shift_~{{OE}}
ShiftReg_Latch: U15.12(RCLK) U17.12(RCLK) ; port ShiftReg_Latch
ShiftRegCLK: U15.11(SRCLK) U17.11(SRCLK) ; port ShiftRegCLK
ShiftRegDATA: U15.14(SER) ; port ShiftRegDATA
NetU15_9: U15.9(QH') U17.14(SER)

Not connected (* = marked no-connect by the designer): U17 9(QH')

### Notes on the sheet
- 1
- 2
- 3
- 4
- 5
- 6
- A
- B
- C
- D
- Title:
- File: Shift register.kicad_sch
- Sheet: /
- KiCad E.D.A.  kicad (5.1.4)-1
- Size: A4
- Date:
- Rev:
- Id: 1/1

### Library data of the parts
C33 C34 = C: Value: 100nF/50V
U15 U17 = 74HC595: MP: 74HC595PW,118; Value: 74HC595PW,118
  U15: Footprint: Package_SO:TSSOP-16_4.4x5mm_P0.65mm

## Nets that join several sheets
+3V3: KNX-RELAY-8CH_V2 (J10.2), Shift register (6 pins)
+12V: KNX-RELAY-8CH_V2 (5 pins), RELAYS (8 pins)
GNDD: KNX-RELAY-8CH_V2 (C5.2 J10.3 Q32.2 R84.1), RELAYS (48 pins), Shift register (C33.1 C34.1 U15.8 U17.8)
R1_A1: RELAYS (R34.2), Shift register (U15.3)
R1_A2: RELAYS (R33.2), Shift register (U15.6)
R1_COM: KNX-RELAY-8CH_V2 (J1.2), RELAYS (R1.11)
R1_NO: KNX-RELAY-8CH_V2 (J1.1), RELAYS (R1.14)
R2_A1: RELAYS (R57.2), Shift register (U17.15)
R2_A2: RELAYS (R56.2), Shift register (U15.2)
R2_COM: KNX-RELAY-8CH_V2 (J2.2), RELAYS (R2.11)
R2_NO: KNX-RELAY-8CH_V2 (J2.1), RELAYS (R2.14)
R3_A1: RELAYS (R61.2), Shift register (U17.4)
R3_A2: RELAYS (R60.2), Shift register (U17.7)
R3_COM: KNX-RELAY-8CH_V2 (J3.2), RELAYS (R3.11)
R3_NO: KNX-RELAY-8CH_V2 (J3.1), RELAYS (R3.14)
R4_A1: RELAYS (R65.2), Shift register (U15.7)
R4_A2: RELAYS (R64.2), Shift register (U17.3)
R4_COM: KNX-RELAY-8CH_V2 (J4.2), RELAYS (R4.11)
R4_NO: KNX-RELAY-8CH_V2 (J4.1), RELAYS (R4.14)
R5_A1: RELAYS (R69.2), Shift register (U17.2)
R5_A2: RELAYS (R68.2), Shift register (U17.1)
R5_COM: KNX-RELAY-8CH_V2 (J5.2), RELAYS (R5.11)
R5_NO: KNX-RELAY-8CH_V2 (J5.1), RELAYS (R5.14)
R6_A1: RELAYS (R73.2), Shift register (U17.6)
R6_A2: RELAYS (R72.2), Shift register (U17.5)
R6_COM: KNX-RELAY-8CH_V2 (J6.2), RELAYS (R6.11)
R6_NO: KNX-RELAY-8CH_V2 (J6.1), RELAYS (R6.14)
R7_A1: RELAYS (R77.2), Shift register (U15.15)
R7_A2: RELAYS (R76.2), Shift register (U15.1)
R7_COM: KNX-RELAY-8CH_V2 (J7.2), RELAYS (R7.11)
R7_NO: KNX-RELAY-8CH_V2 (J7.1), RELAYS (R7.14)
R8_A1: RELAYS (R81.2), Shift register (U15.5)
R8_A2: RELAYS (R80.2), Shift register (U15.4)
R8_COM: KNX-RELAY-8CH_V2 (J8.2), RELAYS (R8.11)
R8_NO: KNX-RELAY-8CH_V2 (J8.1), RELAYS (R8.14)
Shift_~{{OE}}: KNX-RELAY-8CH_V2 (R90.2), Shift register (U15.13 U17.13)
ShiftReg_Latch: KNX-RELAY-8CH_V2 (R89.2), Shift register (U15.12 U17.12)
ShiftRegCLK: KNX-RELAY-8CH_V2 (R87.2), Shift register (U15.11 U17.11)
ShiftRegDATA: KNX-RELAY-8CH_V2 (R88.2), Shift register (U15.14)